# Altium schematic sheet Peltie.SchDoc
size 420 x 297 mm
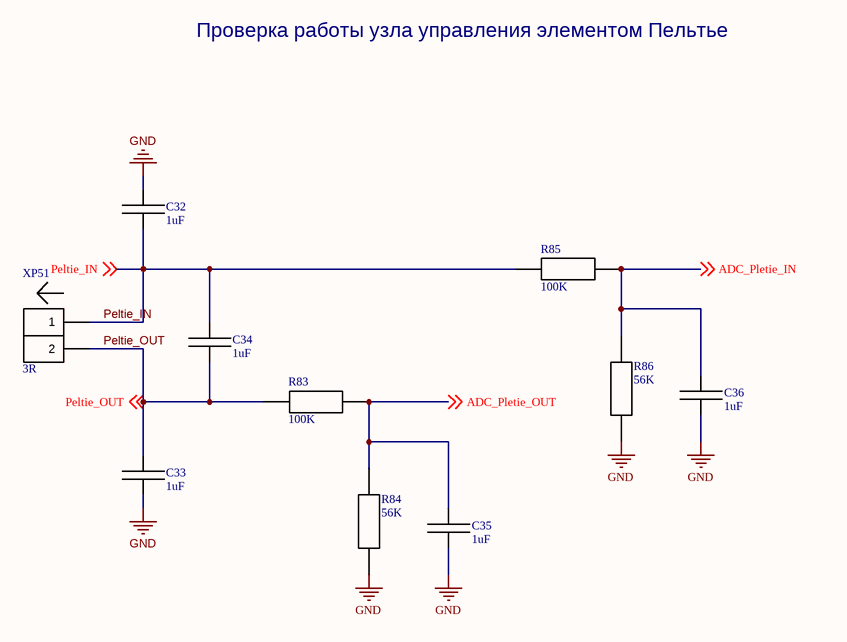
[diagram p0: Peltie.SchDoc]

## Parts
C32  1uF  [0603C]
C33  1uF  [0603C]
C34  1uF  [0603C]
C35  1uF  [0603C]
C36  1uF  [0603C]
R83  100K  [R0402]
R84  56K  [R0402]
R85  100K  [R0402]
R86  56K  [R0402]
XP51  3R  [PLS-2]

## Nets
GND: C32.2 C33.2 C35.1 C36.1 R84.2 R86.2
ADC_Pletie_IN: C36.2 R85.1 R86.1 ; off-sheet ADC_Pletie_IN
ADC_Pletie_OUT: C35.2 R83.1 R84.1 ; off-sheet ADC_Pletie_OUT
Peltie_IN: C32.1 C34.2 R85.2 XP51.1 ; off-sheet Peltie_IN
Peltie_OUT: C33.1 C34.1 R83.2 XP51.2 ; off-sheet Peltie_OUT

## Notes on the sheet
- Проверка работы узла управления элементом Пельтье
- Подп. и дата
- Инв.№ дубл.
- Взам.инв.№
- Подп.и дата
- Инв.№ подл.
- Изм.
- Лист
- № докум.
- Подп.
- Дата
- Формат  A3

## Library data of the parts
C32-C36 = C0603-1uF 10% 50V: Part Number: SMD CAP CER 1uF ±10% 50V X7R 0603; Added_by: grebelny_av@teslatec.ru; Solder_Amount: 2; Pkg: 0603; Created_at: 22/06/2021; MountType: SMD; Mount: MOUNT
R83 R85 = R0402-100K: Resistor SMD 100K 1% 0402; Part Number: SMD RES 100 KOHM 1% ±100ppm/°C 0402; Added_by: Rutel@teslatec.ru; Solder_Amount: 2; Pkg: 0402; Created_at: 21/04/2020; MountType: SMD; Mount: MOUNT
R84 R86 = R0402-56K: Resistor SMD 56K 1% 0402; Part Number: SMD RES 56K KOHM 1% ±100ppm/°C 0402; Added_by: ridel_av@teslatec.ru; Solder_Amount: 2; Pkg: 0402; Created_at: 15/12/2021; MountType: SMD; Mount: MOUNT
XP51 = PLS-2_peltie: SQP10AJB-3R; Added_by: irdolgopolowa@yandex.ru; Solder_Amount: 2; Created_at: 29/10/24; Mount: MOUNT; MountType: THM; Part Number: PLS-2; Pkg: PLS-2; Mating Part: SQP10AJB-3R